# Altium project 压控放大器VCA822.PrjPcb
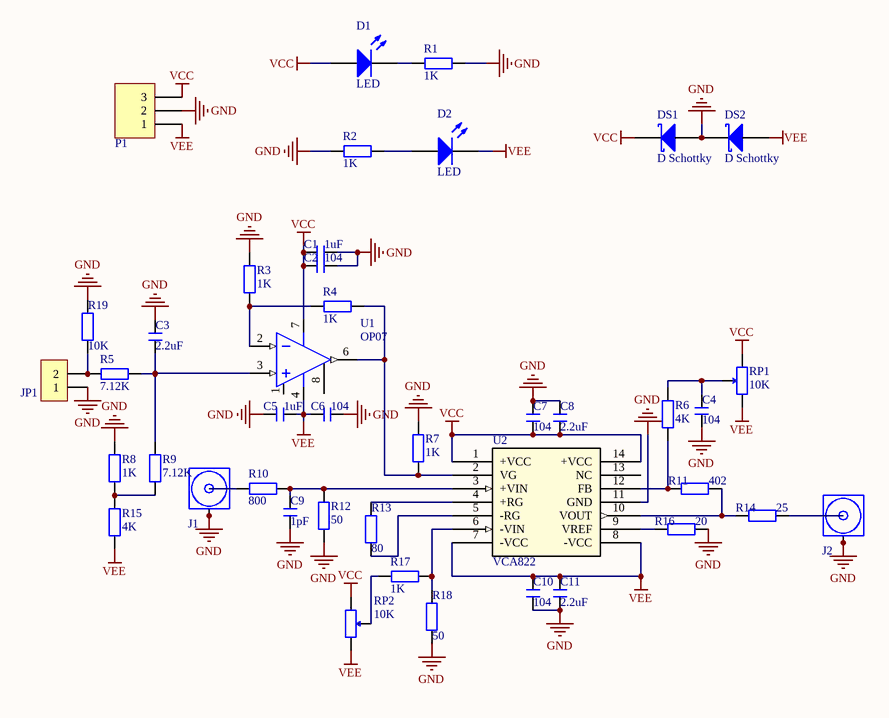
[diagram p0: VCA822.SchDoc]
1 sheet, 42 parts. Net scope: global (net labels, ports and power ports of the same name join across sheets).
Board file: VCA822.PcbDoc

## Sheet VCA822.SchDoc
size A4

### Parts
C1  1uF  [C 0603]
C2  104  [C 0603]
C3  2.2uF  [C 0603]
C4  104  [C 0603]
C5  1uF  [C 0603]
C6  104  [C 0603]
C7  104  [C 0603]
C8  2.2uF  [C 0603]
C9  1pF  [C 0603]
C10  104  [C 0603]
C11  2.2uF  [C 0603]
D1  LED  [LED_0805]
D2  LED  [LED_0805]
DS1  D Schottky  [DIODE-SMA]
DS2  D Schottky  [DIODE-SMA]
J1  COAX  [MCX5.08-5-H]  (value not drawn)
J2  COAX  [MCX5.08-5-H]  (value not drawn)
JP1  HDR-1X2  [HDR-1X2]  (value not drawn)
P1  Header 3  [HDR3X1_B2]  (value not drawn)
R1  1K  [R 0805]
R2  1K  [R 0805]
R3  1K  [R 0603]
R4  1K  [R 0603]
R5  7.12K  [R 0603]
R6  4K  [R 0603]
R7  1K  [R 0603]
R8  1K  [R 0603]
R9  7.12K  [R 0603]
R10  800  [R 0603]
R11  402  [R 0603]
R12  50  [R 0603]
R13  80  [R 0603]
R14  25  [R 0603]
R15  4K  [R 0603]
R16  20  [R 0603]
R17  1K  [R 0603]
R18  50  [R 0603]
R19  10K  [R 0603]
RP1  10K  [3296W]
RP2  10K  [3296W]
U1  OP07  [SO8_L]
U2  VCA822  [SOIC14_N]

### Nets
GND: C1.1 C2.1 C3.1 C4.1 C5.2 C6.1 C7.2 C8.2 C9.2 C10.2 C11.1 DS1.1 DS2.2 J1.2(GND) J1.3(GND) J1.4(GND) J1.5(GND) J2.2(GND) J2.3(GND) J2.4(GND) J2.5(GND) JP1.1 P1.2 R1.2 R2.1 R3.2 R7.1 R8.2 R12.1 R16.2 R18.1 R19.2 U2.11(GND)
VCC: C1.2 C2.2 C7.1 C8.1 D1.1(A) DS1.2 P1.3 RP1.1 RP2.1 U1.7(V+) U2.1(+VCC) U2.14(+VCC)
VEE: C5.1 C6.2 C10.1 C11.2 D2.2(K) DS2.1 P1.1 R15.1 RP1.3 RP2.3 U1.4(V-) U2.7(-VCC) U2.8(-VCC)
NetC3_2: C3.2 R5.1 R9.1 U1.3(IN+)
NetC4_2: C4.2 R6.2 RP1.2
NetC9_1: C9.1 R10.1 R12.2 U2.3(+VIN)
NetD1_2: D1.2(K) R1.1
NetD2_1: D2.1(A) R2.2
NetJ1_1: J1.1(Signal) R10.2
NetJ2_1: J2.1(Signal) R14.2
NetJP1_2: JP1.2 R5.2 R19.1
NetR3_1: R3.1 R4.1 U1.2(IN-)
NetR4_2: R4.2 R7.2 U1.6(OUT) U2.2(VG)
NetR6_1: R6.1 R11.1 U2.12(FB)
NetR8_1: R8.1 R9.2 R15.2
NetR11_2: R11.2 R14.1 U2.10(VOUT)
NetR13_1: R13.1 U2.5(-RG)
NetR13_2: R13.2 U2.4(+RG)
NetR16_1: R16.1 U2.9(VREF)
NetR17_1: R17.1 R18.2 U2.6(-VIN)
NetR17_2: R17.2 RP2.2

Not connected (* = marked no-connect by the designer): U1 1(OFFSET_N1) 8(OFFSET_N2); U2 13(NC)

### Library data of the parts
C1-C11 = C: 无极性贴片电容; 版权归属: 源创客; BOM名称: 无极性贴片电容; 学习资源: www.ooocke.com
D1 D2 = LED: 发光二极管; Published: 8-Jun-2000; LatestRevisionDate: 08-Jul-2005; LatestRevisionNote: Mech Layer 1 removed.; PackageReference: LED; Publisher: Altium Limited
DS1 DS2 = D Schottky: Schottky Diode; Published: 8-Jun-2000; LatestRevisionDate: 17-Jul-2002; LatestRevisionNote: Re-released for DXP Platform.; PackageReference: SMB; Publisher: Altium Limited; PackageDescription: DO-214-AA/SMB; 2 C-Bend Leads; Body 5.3 x 3.6 mm, inc. leads (LxW); Code_JEDEC: DO-214-AA
JP1 = Header 2: 2P接插件; 版权归属: 源创客; BOM名称: 2P接插件; 学习资源: www.ooocke.com
P1 = Header 3: 接插件; LatestRevisionDate: 17-Jul-2002; LatestRevisionNote: Re-released for DXP Platform.; Publisher: Altium Limited
R1-R19 = R: 贴片电阻; 版权归属: 源创客; BOM名称: 贴片电阻; 学习资源: www.ooocke.com
RP1 RP2 = RP-ID: 插件单联电位器; BOM名称: 插件电位器; 版权归属: 源创客; 学习资源: www.ooocke.com
U1 = OP07: Precision Operational Amplifiers
U2 = VCA822: VCA822 Wideband, > 40-dB Gain Adjust Range, Linear in V/V Variable Gain Amplifier; Manufacturer: Texas Instruments; GENERIC_PART_NUMBER: VCA821; Manufacturer_Part_Number: vca821_d_14; INDUSTRY_STD_PKG_TYPE: SOIC; PIN_COUNT: 14; PACKAGE_DESIGNATOR: D; Datasheet URL: http://www.ti.com/lit/gpn/VCA821; FAMILY_NAME: VARIABLE GAIN AMPLIFIER; Vendor: Texas Instruments; RefDes: RefDes; Type: DEV; Value: Value